# Altium schematic sheet E1706D_Schematic.SchDoc
size B; SheetNumber: 1; SheetTotal: 2
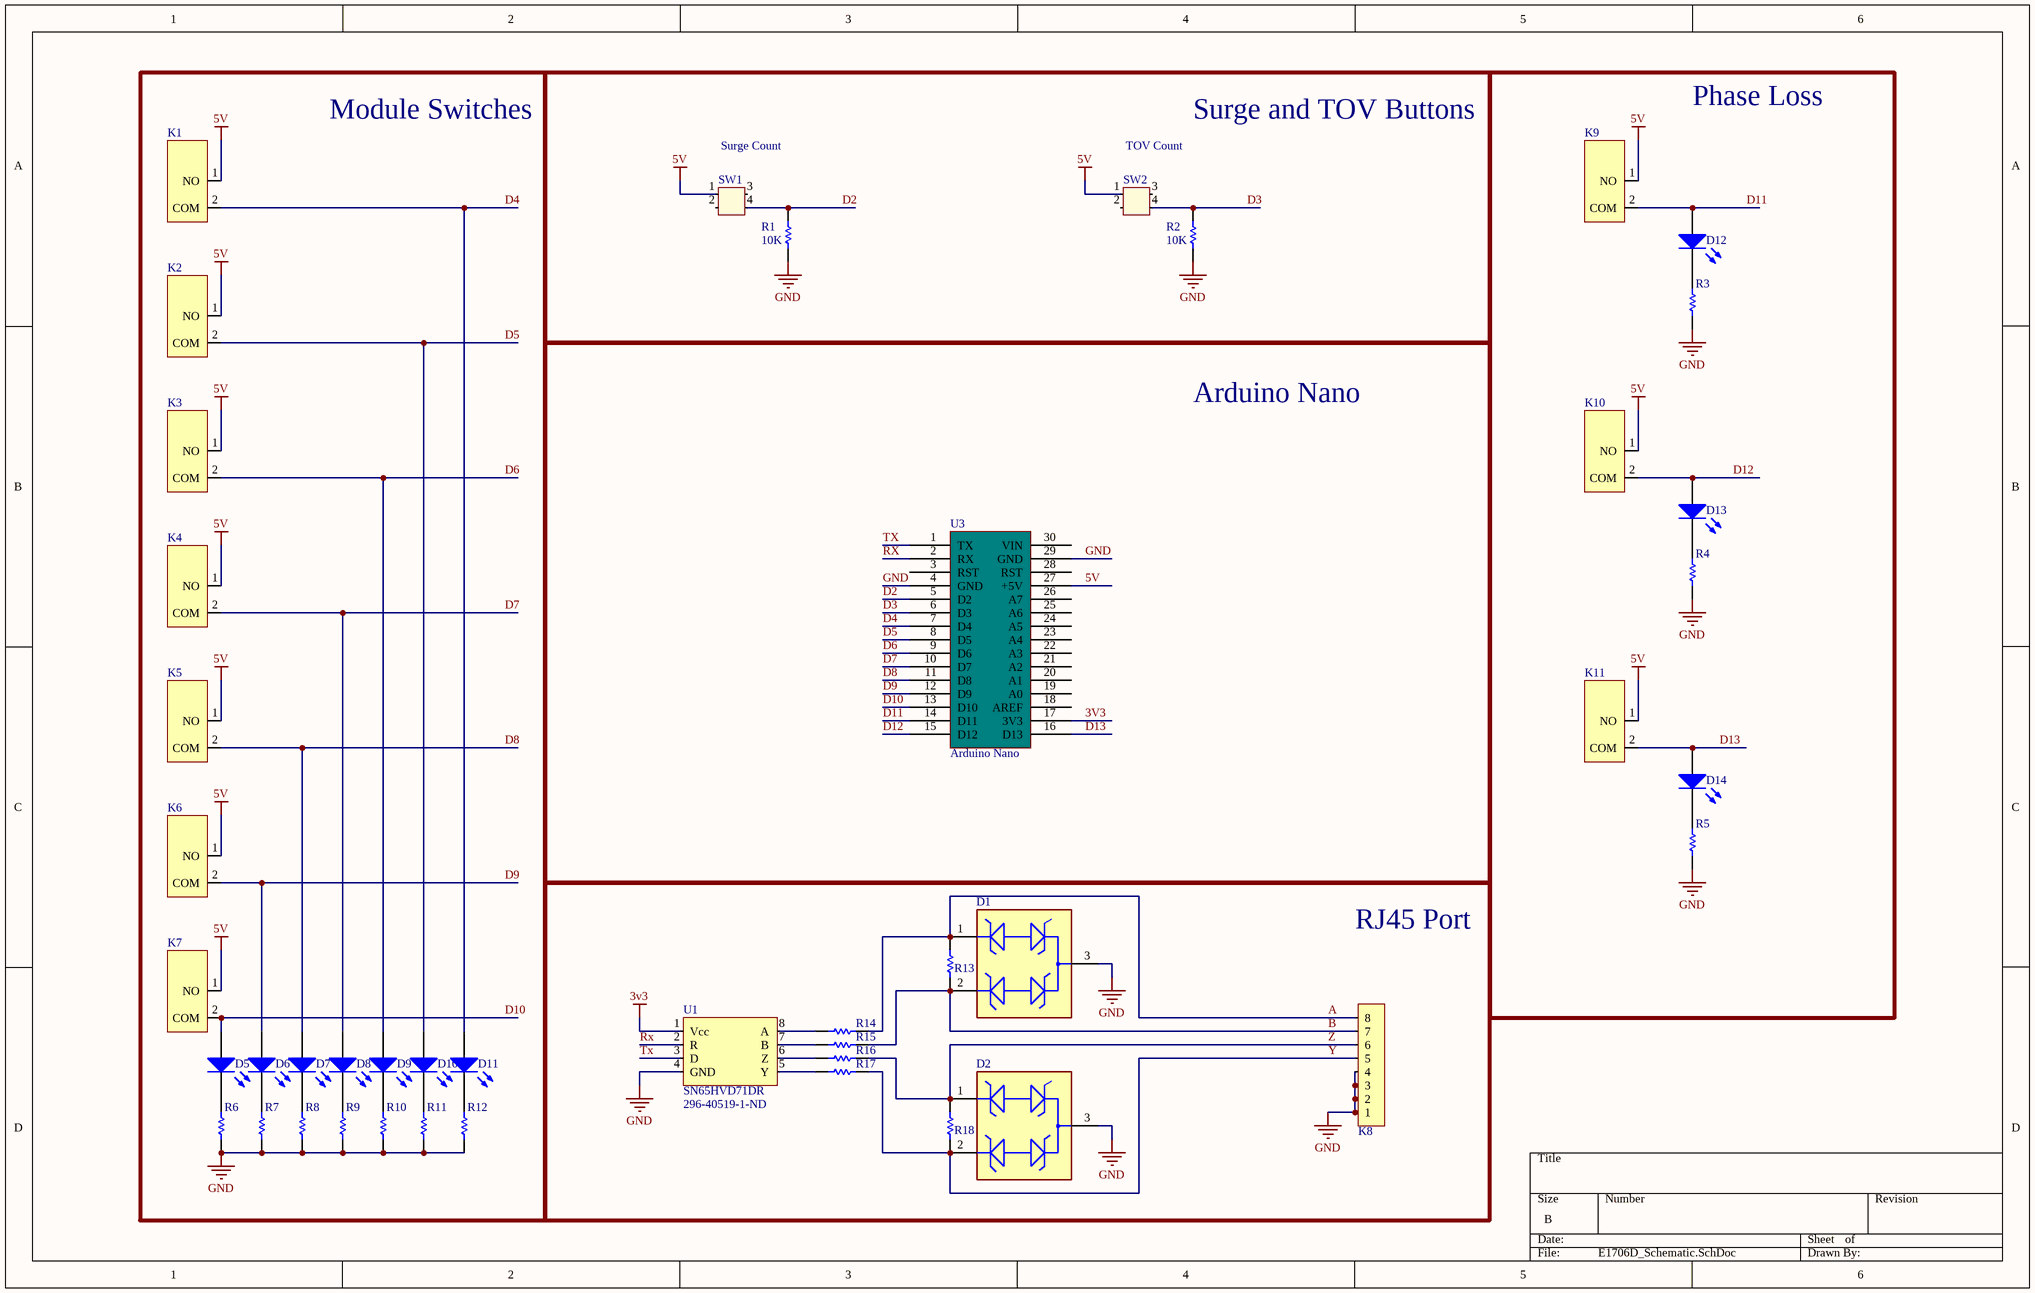
[diagram p0: E1706D_Schematic.SchDoc]

## Parts
D1  CDSOT23-SM712  [FP-SOT23-MFG]  (value not drawn)
D2  CDSOT23-SM712  [FP-SOT23-MFG]  (value not drawn)
D5  LED_RED_0603  [LED_LTST-C190KRKT]  (value not drawn)
D6  LED_RED_0603  [LED_LTST-C190KRKT]  (value not drawn)
D7  LED_RED_0603  [LED_LTST-C190KRKT]  (value not drawn)
D8  LED_RED_0603  [LED_LTST-C190KRKT]  (value not drawn)
D9  LED_RED_0603  [LED_LTST-C190KRKT]  (value not drawn)
D10  LED_RED_0603  [LED_LTST-C190KRKT]  (value not drawn)
D11  LED_RED_0603  [LED_LTST-C190KRKT]  (value not drawn)
D12  LED_RED_0603  [LED_LTST-C190KRKT]  (value not drawn)
D13  LED_RED_0603  [LED_LTST-C190KRKT]  (value not drawn)
D14  LED_RED_0603  [LED_LTST-C190KRKT]  (value not drawn)
K1  RA11131100  [RA11131100]  (value not drawn)
K2  RA11131100  [RA11131100]  (value not drawn)
K3  RA11131100  [RA11131100]  (value not drawn)
K4  RA11131100  [RA11131100]  (value not drawn)
K5  RA11131100  [RA11131100]  (value not drawn)
K6  RA11131100  [RA11131100]  (value not drawn)
K7  RA11131100  [RA11131100]  (value not drawn)
K8  6339191-5  [6339191-5]  (value not drawn)
K9  RA11131100  [RA11131100]  (value not drawn)
K10  RA11131100  [RA11131100]  (value not drawn)
K11  RA11131100  [RA11131100]  (value not drawn)
R1  10K  [RESC2012N]
R2  10K  [RESC2012N]
R3  150  [RESC2012N]  (value not drawn)
R4  150  [RESC2012N]  (value not drawn)
R5  150  [RESC2012N]  (value not drawn)
R6  150  [RESC2012N]  (value not drawn)
R7  150  [RESC2012N]  (value not drawn)
R8  150  [RESC2012N]  (value not drawn)
R9  150  [RESC2012N]  (value not drawn)
R10  150  [RESC2012N]  (value not drawn)
R11  150  [RESC2012N]  (value not drawn)
R12  150  [RESC2012N]  (value not drawn)
R13  Res_120_0805  [RESC2012N]  (value not drawn)
R14  Res_10_0805  [RESC2012N]  (value not drawn)
R15  Res_10_0805  [RESC2012N]  (value not drawn)
R16  Res_10_0805  [RESC2012N]  (value not drawn)
R17  Res_10_0805  [RESC2012N]  (value not drawn)
R18  Res_120_0805  [RESC2012N]  (value not drawn)
SW1  PTS645SL50-2 LFS  [PTS645SL50-2 LFS]  (value not drawn)
SW2  PTS645SL50-2 LFS  [PTS645SL50-2 LFS]  (value not drawn)
U1  SN65HVD71DR  Supplier Part Number 1: 296-40519-1-ND  [SN65HVD71DR]
U3  Arduino Nano  [Arduino Nano]

## Blocks framed on the sheet
Module Switches: D5-D11 K1-K7 R6-R12
Surge and TOV Buttons: R1 R2 SW1 SW2
Phase Loss: D12-D14 K9-K11 R3-R5
Arduino Nano: U3
RJ45 Port: D1 D2 K8 R13-R18 U1

## Nets
3V3: U1.1(Vcc) U3.17(3V3)
5V: K1.1(NO) K2.1(NO) K3.1(NO) K4.1(NO) K5.1(NO) K6.1(NO) K7.1(NO) K9.1(NO) K10.1(NO) K11.1(NO) SW1.1 SW2.1 U3.27(+5V)
GND: D1.3 D2.3 K8.1 K8.2 K8.3 K8.4 R1.1 R2.1 R3.1 R4.1 R5.1 R6.1 R7.1 R8.1 R9.1 R10.1 R11.1 R12.1 U1.4(GND) U3.4(GND) U3.29(GND)
A: D1.1 K8.8 R13.2 R14.2
B: D1.2 K8.7 R13.1 R15.2
D2: R1.2 SW1.4 U3.5(D2)
D3: R2.2 SW2.4 U3.6(D3)
D4: D11.2 K1.2(COM) U3.7(D4)
D5: D10.2 K2.2(COM) U3.8(D5)
D6: D9.2 K3.2(COM) U3.9(D6)
D7: D8.2 K4.2(COM) U3.10(D7)
D8: D7.2 K5.2(COM) U3.11(D8)
D9: D6.2 K6.2(COM) U3.12(D9)
D10: D5.2 K7.2(COM) U3.13(D10)
D11: D12.2 K9.2(COM) U3.14(D11)
D12: D13.2 K10.2(COM) U3.15(D12)
D13: D14.2 K11.2(COM) U3.16(D13)
RX: U1.2(R) U3.2(RX)
TX: U1.3(D) U3.1(TX)
Y: D2.2 K8.5 R17.2 R18.1
Z: D2.1 K8.6 R16.2 R18.2
NetD5_1: D5.1 R6.2
NetD6_1: D6.1 R7.2
NetD7_1: D7.1 R8.2
NetD8_1: D8.1 R9.2
NetD9_1: D9.1 R10.2
NetD10_1: D10.1 R11.2
NetD11_1: D11.1 R12.2
NetD12_1: D12.1 R3.2
NetD13_1: D13.1 R4.2
NetD14_1: D14.1 R5.2
NetR14_1: R14.1 U1.8(A)
NetR15_1: R15.1 U1.7(B)
NetR16_1: R16.1 U1.6(Z)
NetR17_1: R17.1 U1.5(Y)

Not connected (* = marked no-connect by the designer): SW1 2 3; SW2 2 3; U3 3(RST) 18(AREF) 19(A0) 20(A1) 21(A2) 22(A3) 23(A4) 24(A5) 25(A6) 26(A7) 28(RST) 30(VIN)

## Notes on the sheet
- (near SW1) Surge Count
- (near SW2) TOV Count

## Library data of the parts
D1 D2 = CMP-2000-05081-2: TVS DIODE 7V/12V 14V/26V SOT23-3; Manufacturer: Bourns Inc.; Peak Pulse Current: 17A; Standoff Height: 0.05mm; Breakdown Voltage: 7.5V; Direction: Bidirectional; Clamping Voltage: 26V; Value: 75pF; Number Of Channels: 2; Reverse Standoff Voltage: 12V; Peak Pulse Power: 400W; Max Surge Current: 30A; Polarity: Bidirectional,Unidirectional; Min Breakdown Voltage: 13.3V; Power Line Protection: No; Leakage Current: 20uA; Element Configuration: Dual; Diode Type: ZENER; Max Power Dissipation: 600W; Test Current: 1mA; ESD Protection: Yes; Temperature Range Low: -55°C; Mouser Description: Transient Voltage Suppressor, TVS, CDSOT23 Series, Unidirectional, 12 V, SOT-23, 3, 13.3 V; Device Class L3: unset; Package: SOT23; Height: 1.17mm; RoHS: TRUE; Octopart: https://octopart.com/cdsot23-sm712-bourns-7576327; Category: Diode; Ipc Land Pattern Name: SOT95P229X103-3; ComponentLink2URL: https://www.bourns.com/docs/Product-Datasheets/CDSOT23-SM712.pdf; Temperature Range High: +150°C; ComponentLink2Description: Datasheet; Digikey Description: TVS DIODE 7V/12V 14V/26V SOT23-3; Manufacturer Part Number: CDSOT23-SM712; Temperature: -55°C to +150°C; Device Class L2: TVS Diodes; Lead Free: Yes; Device Class L1: Circuit Protection; Automotive: No; Capacitance: 75pF; Supplier 1: Digi-Key; Supplier Part Number 1: CDSOT23-SM712CT-ND; Stock 1: 37537; Pricing 1: 1=1.63000, 10=1.46000, 100=1.13850, 500=0.94050, 1000=0.74250 (USD); Mount: Surface Mount; Case/Package: SOT-23; Number of Pins: 3; Contact Plating: Tin; Min Operating Temperature: -55°C; Max Operating Temperature: 150°C; Packaging: Tape and Reel; Package Quantity: 1; Series: -; Working Voltage: 12V; Termination: SMD/SMT; Resistor Type: Zener; Number of Elements: 2; Reverse Breakdown Voltage: 13.3V; Number of Bidirectional Channels: 2; Power Dissipation: 400W; Max Reverse Leakage Current: 20uA; Max Breakdown Voltage: 13.3V; Length: 3.04mm; Width: 0.055inch; Depth: 1.4mm; Radiation Hardening: No; REACH SVHC: No SVHC; RoHS Compliant: Yes; ComponentLink1URL: https://datasheet.ciiva.com/1281/1670933-1281331.pdf?src-supplier=Farnell; ComponentLink1Description: https://datasheet.ciiva.com/1281/1670933-1281331.pdf?src-supplier=Farnell; ComponentLink3URL: https://datasheet.ciiva.com/4510/cdsot23-sm712-25932-4510261.pdf?src-supplier=Mouser; ComponentLink3Description: https://datasheet.ciiva.com/4510/cdsot23-sm712-25932-4510261.pdf?src-supplier=Mouser; ComponentLink4URL: https://datasheet.ciiva.com/11193/cdsot23-sm712-11193846.pdf?src-supplier=Avnet; ComponentLink4Description: https://datasheet.ciiva.com/11193/cdsot23-sm712-11193846.pdf?src-supplier=Avnet; ComponentLink5URL: https://datasheet.ciiva.com/16582/cdsot23-sm712-16582189.pdf?src-supplier=Avnet+Europe; ComponentLink5Description: https://datasheet.ciiva.com/16582/cdsot23-sm712-16582189.pdf?src-supplier=Avnet+Europe; ComponentLink6URL: https://datasheet.ciiva.com/337/cdsot23-sm712-337451.pdf?src-supplier=Digi-Key; ComponentLink6Description: https://datasheet.ciiva.com/337/cdsot23-sm712-337451.pdf?src-supplier=Digi-Key; ComponentLink7URL: https://datasheet.ciiva.com/337/cdsot23-sm712-337452.pdf?src-supplier=Digi-Key; ComponentLink7Description: https://datasheet.ciiva.com/337/cdsot23-sm712-337452.pdf?src-supplier=Digi-Key; ComponentLink8URL: https://datasheet.ciiva.com/26828/getdatasheetpartid-418501-26828522.pdf?src-supplier=Verical; ComponentLink8Description: https://datasheet.ciiva.com/26828/getdatasheetpartid-418501-26828522.pdf?src-supplier=Verical; ComponentLink9URL: https://datasheet.ciiva.com/22696/1670933-22696779.pdf?src-supplier=Element14; ComponentLink9Description: https://datasheet.ciiva.com/22696/1670933-22696779.pdf?src-supplier=Element14
D5-D14 = LED_RED_LTST-C190: LED RED 0603 SMD; Manufacturer: Vishay Lite-On; Manufacturer P/N: LTST-C190KRKT; Lens Color: Clear,Colorless; Luminous Intensity: 54mcd; Forward Current: 30mA; Viewing Angle: 130°; Forward Voltage: 2.4V; Lens Style: Clear,Colorless,Diffused,Rectangular; Power Rating: 75mW; Dominant Wavelength: 631nm; Test Current: 20mA; Lens Transparency: Clear; Number of Elements: 1; Wavelength: 639nm; Reverse Voltage: 5V; Supplier 1: Digi-Key; Supplier Part Number 1: 160-1436-1-ND; Mount: Surface Mount; Case/Package: 0603; Number of Pins: 2; Case Code (Metric): 1608; Case Code (Imperial): 0603; Min Operating Temperature: -55°C; Max Operating Temperature: 85°C; Package Quantity: 1; Illumination Color: Red; Power Dissipation: 75mW; Number of LEDs: 1; Length: 1.6mm; Height: 0.8mm; Width: 0.8mm; Depth: 0.8mm; Radiation Hardening: No; Lead Free: Lead Free; ComponentLink3URL: http://optoelectronics.liteon.com/upload/download/DS-22-99-0151/LTST-C190KRKT.pdf; ComponentLink3Description: http://optoelectronics.liteon.com/upload/download/DS-22-99-0151/LTST-C190KRKT.pdf
R1 R2 = Res_10K_0805: RES 10K OHM 1/8W 1% 0805; Manufacturer: Vishay; Manufacturer P/N: CRCW080510K0FKEA; Resistance: 10kR; Power Rating: 125mW; Voltage Rating: 150V; Temperature Coefficient: 100ppm/°C; Supplier 1: Digi-Key; Supplier Part Number 1: 541-10.0KCCT-ND; Case/Package: 0805; Weight: 0.000194oz; Case Code (Imperial): 0805; Case Code (Metric): 2012; Contact Plating: Tin; Min Operating Temperature: -55°C; Max Operating Temperature: 155°C; Tolerance: 1%; Package Quantity: 5000; Composition: Thick Film; Military Standard: Not; Termination: SMD/SMT; Voltage Rating (DC): 150V; Length: 2mm; Height: 0.45mm; Width: 1.25mm; Depth: 1.25mm; Radiation Hardening: No; REACH SVHC: Unknown; Lead Free: Lead Free; ComponentLink4URL: http://www.vishay.com/docs/20035/dcrcwe3.pdf; ComponentLink4Description: http://www.vishay.com/docs/20035/dcrcwe3.pdf
R3-R12 = Res_150_0805: RES 150 OHM 1/8W 1% 0805; Manufacturer: Vishay; Manufacturer P/N: CRCW0805150RFKEA; Power Rating: 125mW; Resistance: 150R; Voltage Rating: 150V; Temperature Coefficient: 100ppm/°C; Supplier 1: Digi-Key; Supplier Part Number 1: 541-150CCT-ND; Mount: Surface Mount; Case/Package: 0805; Weight: 0.000194oz; Case Code (Metric): 2012; Case Code (Imperial): 0805; Contact Plating: Tin; Min Operating Temperature: -55°C; Max Operating Temperature: 155°C; Tolerance: 1%; Package Quantity: 10; Composition: Thick Film; Termination: SMD/SMT; Max Power Dissipation: 125mW; Voltage Rating (DC): 150V; Features: Automotive AEC-Q200; Military Standard: Not; Length: 2mm; Height: 0.45mm; Width: 0.049inch; Depth: 1.25mm; Radiation Hardening: No; Lead Free: Lead Free; REACH SVHC: Unknown; ComponentLink3URL: http://www.vishay.com/docs/20035/dcrcwe3.pdf; ComponentLink3Description: http://www.vishay.com/docs/20035/dcrcwe3.pdf
R13 R18 = Res_120_0805: RES 120 OHM 1/8W 1% 0805
R14-R17 = Res_10_0805: RES 10 OHM 1/8W 1% 0805; Manufacturer: Vishay Dale; Manufacturer P/N: CRCW080510R0FKEA; Power (Watts): 0.125W, 1/8W; Temperature Coefficient: ±100ppm/°C; Resistance (Ohms): 10; Supplier 1: Digi-Key; Supplier Part Number 1: 541-10.0CCT-ND; RoHS: RoHS Compliant; Composition: Thick Film; Features: Automotive AEC-Q200 Qualified; Tolerance: ±1%; Package / Case: 0805 (2012 Metric); ComponentLink1URL: http://www.vishay.com/doc?20035; ComponentLink1Description: Datasheet; Supplier 2: Digi-Key; Supplier Part Number 2: 541-10.0CTR-ND
U1 = SN65HVD71DR: Single Transmitter/Receiver RS-485 8-Pin SOIC T/R; Manufacturer: Texas Instruments; Data Rate: 400Kbps; Number of Transmitters: 1; Operating Supply Voltage: 3.3V; Simplex/Duplex: Full Duplex; Receiver Hysteresis: 70mV; Supplier 1: Digi-Key; Manufacturer Part Number: SN65HVD71DR; RoHS: Yes; Category: RS-232 / RS-422 / RS-485 Interface ICs; Stock 1: 1611; Pricing 1: 1=3.41000, 10=3.06300, 25=2.89520, 100=2.50930, 250=2.38064, 500=2.13616, 1000=2.12450 (USD); Mount: Surface Mount; Case/Package: SOIC; Number of Pins: 8; Min Operating Temperature: -40°C; Max Operating Temperature: 125°C; Packaging: Tape and Reel; Logic Function: Receiver; Lead Free: Lead Free; RoHS Compliant: Yes; ComponentLink1URL: https://datasheet.ciiva.com/48475/sn65hvd70-48475464.pdf?src-supplier=Avnet; ComponentLink1Description: https://datasheet.ciiva.com/48475/sn65hvd70-48475464.pdf?src-supplier=Avnet
U3 = DFR0100: Supplier 1: Digi-Key; Supplier Part Number 1: 1738-1026-ND